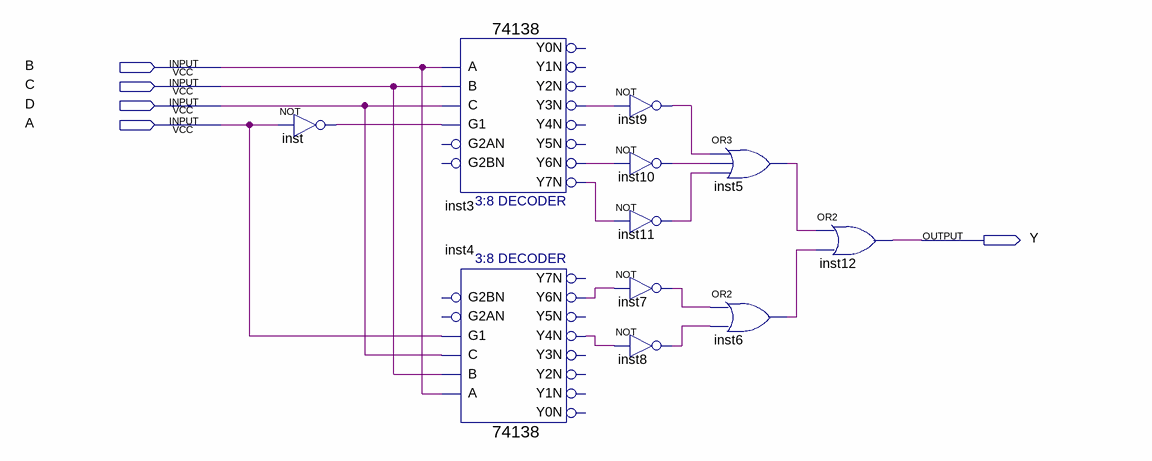
[diagram p0: schematic sheet]
// Quartus schematic exp03.bdf as structural Verilog: 11 symbols, 5 pins
module exp03 (
  input  B,
  input  C,
  input  D,
  input  A,
  output Y
);

  wire inst3_y3n, inst3_y6n, inst3_y7n, inst4_y4n, inst4_y6n, inst5_out, inst6_out, inst7_out, inst8_out,
       inst9_out, inst10_out, inst11_out, inst_out;

  not inst (inst_out, A);
  \74138  inst3 (
    .A(B), .B(C), .G1(inst_out), .C(D), .Y3N(inst3_y3n), .Y6N(inst3_y6n), .Y7N(inst3_y7n));  // open: G2AN, G2BN, Y0N, Y1N, Y2N, Y4N, Y5N
  \74138  inst4 (
    .A(B), .B(C), .G1(A), .C(D), .Y4N(inst4_y4n), .Y6N(inst4_y6n));  // open: G2AN, G2BN, Y0N, Y1N, Y2N, Y3N, Y5N, Y7N
  not inst9 (inst9_out, inst3_y3n);
  not inst10 (inst10_out, inst3_y6n);
  not inst11 (inst11_out, inst3_y7n);
  not inst7 (inst7_out, inst4_y6n);
  not inst8 (inst8_out, inst4_y4n);
  or inst5 (inst5_out, inst9_out, inst10_out, inst11_out);
  or inst6 (inst6_out, inst7_out, inst8_out);
  or inst12 (Y, inst5_out, inst6_out);
endmodule
